# Altium project dashcam_cpu_v2.0.PrjPcb (part 7 of 13)

## Sheet dram_lpddr4.SchDoc
size A2; SheetNumber: 9; SheetTotal: 15
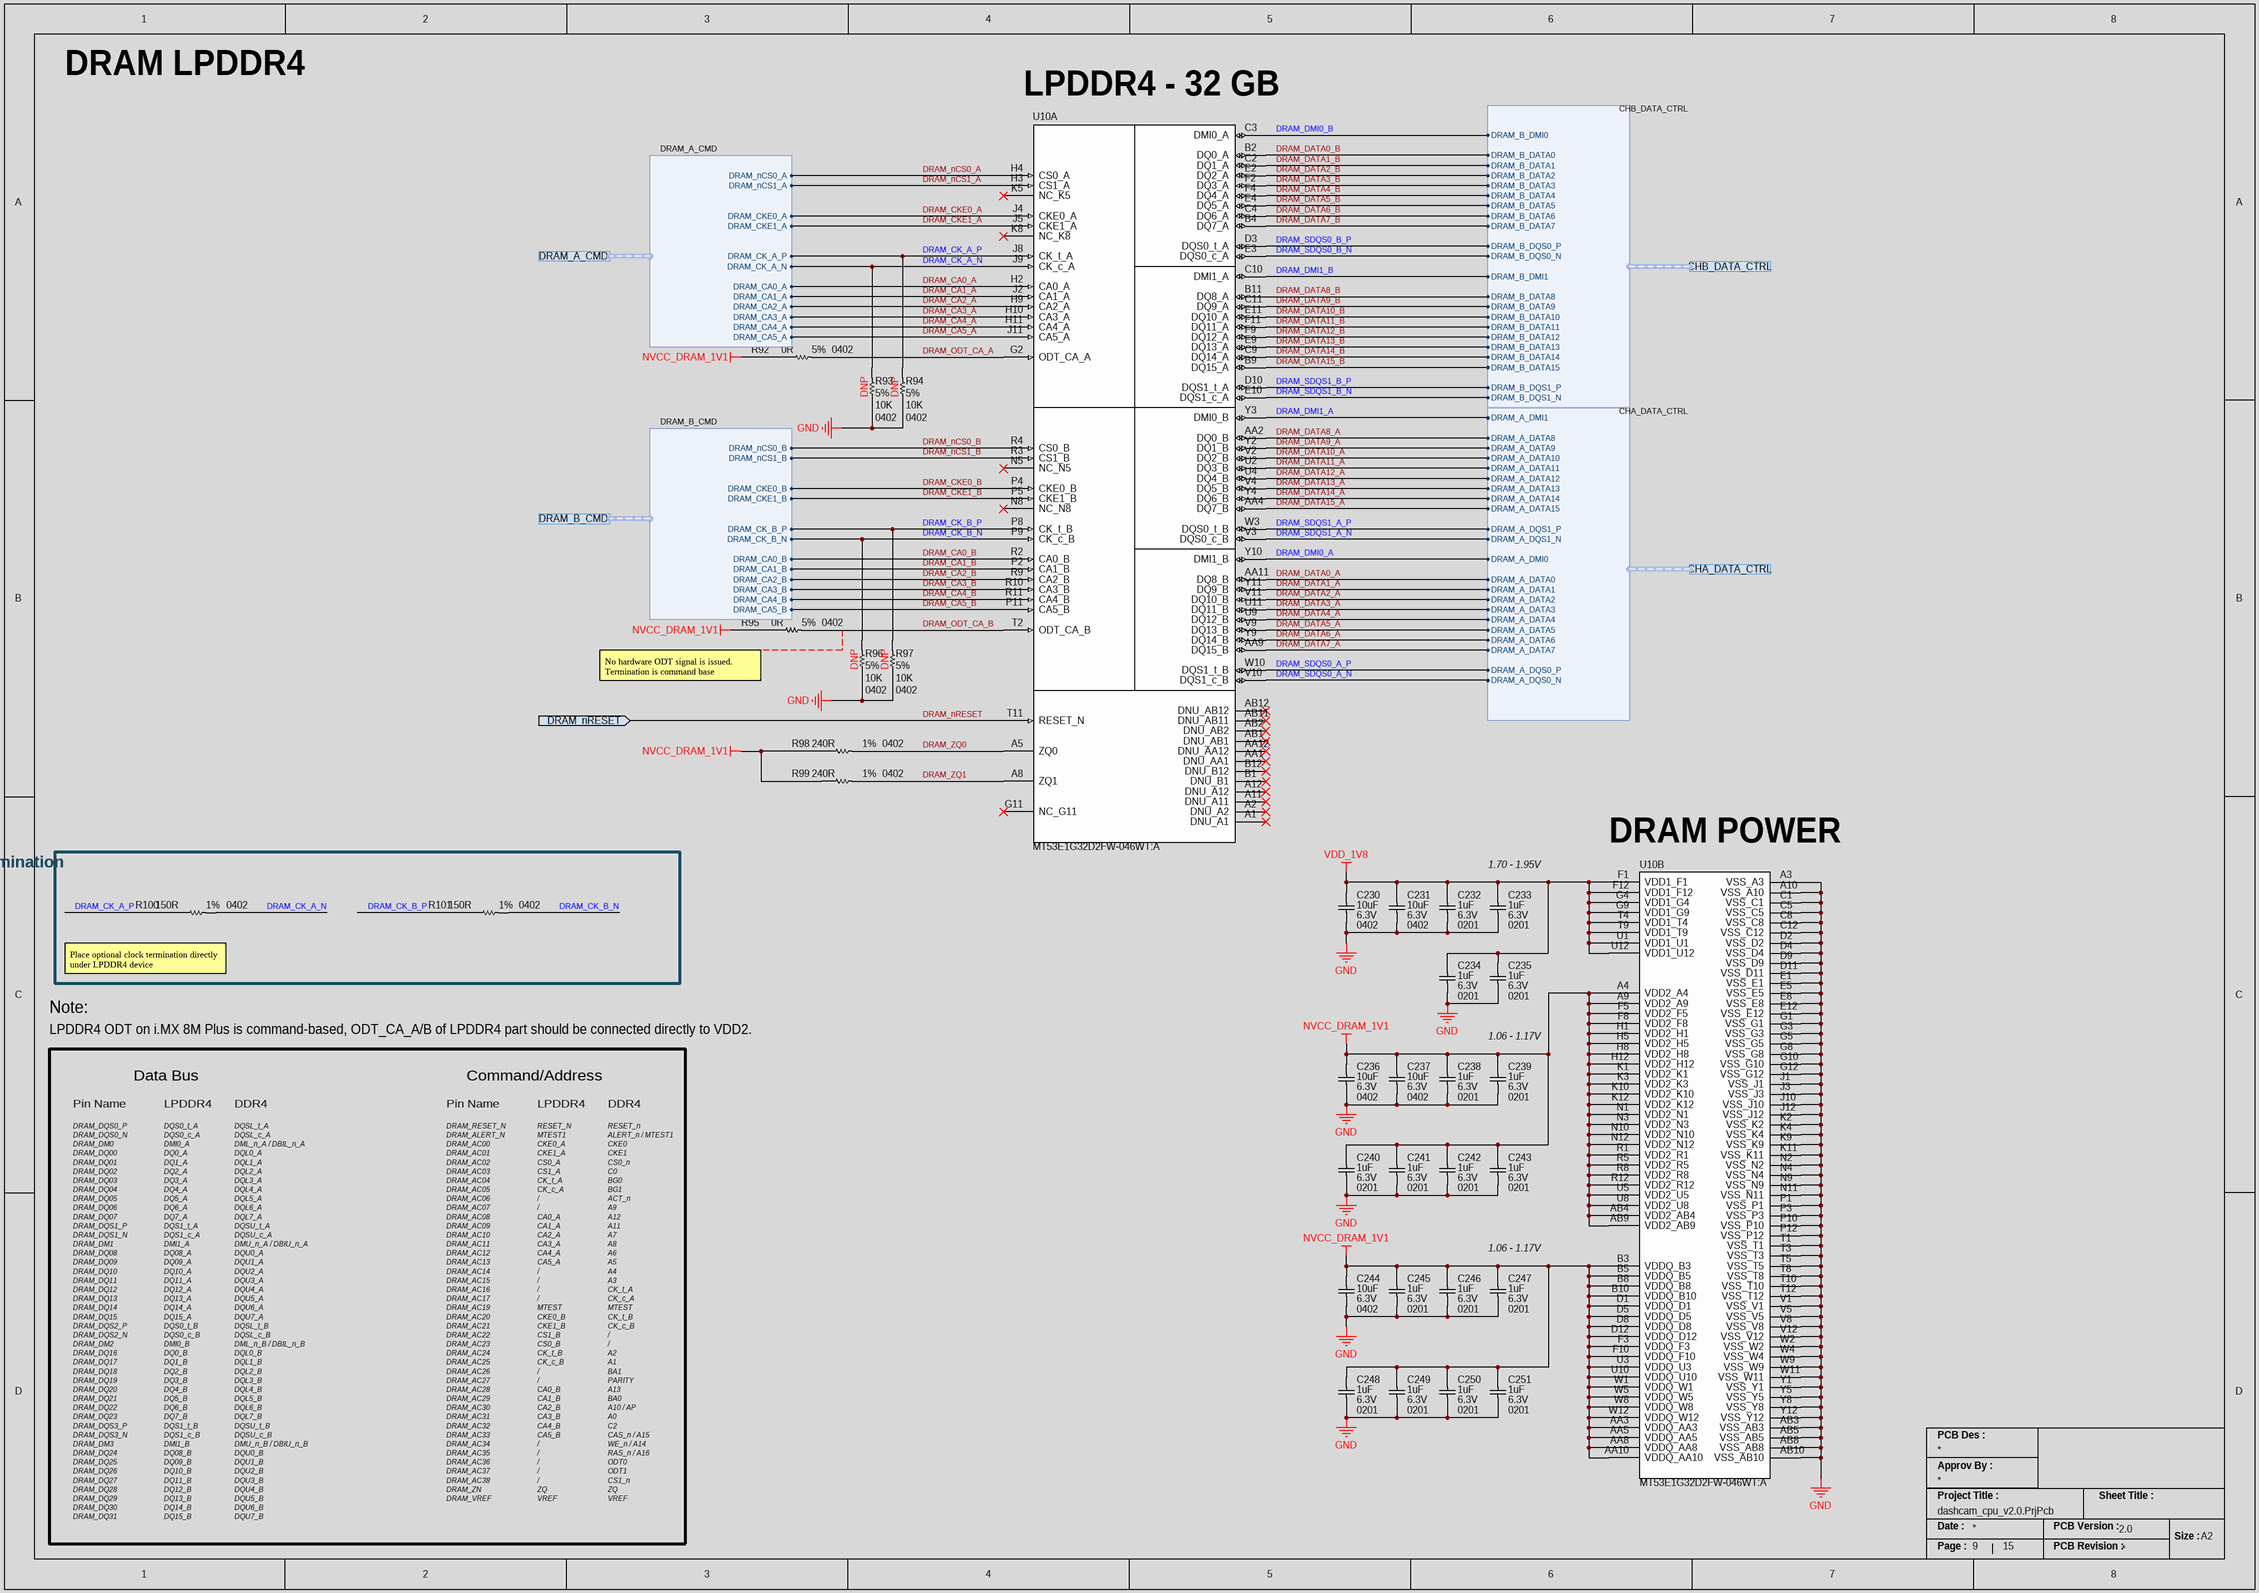
[diagram p9: dram_lpddr4.SchDoc]

### Parts
C230  Case/Package: 0402  Capacitance: 10uF  Voltage Rating: 6.3V  [CAP_0402_CAPC1005X05N]  (hidden comment: CL05A106MQ5NUNC)
C231  Case/Package: 0402  Capacitance: 10uF  Voltage Rating: 6.3V  [CAP_0402_CAPC1005X05N]  (hidden comment: CL05A106MQ5NUNC)
C232  Voltage Rating (DC): 6.3V  Capacitance: 1uF  Case/Package: 0201  [CAP_0201_CAPC0603X03N]  (hidden comment: 02016D105MAT2A)
C233  Voltage Rating (DC): 6.3V  Capacitance: 1uF  Case/Package: 0201  [CAP_0201_CAPC0603X03N]  (hidden comment: 02016D105MAT2A)
C234  Voltage Rating (DC): 6.3V  Capacitance: 1uF  Case/Package: 0201  [CAP_0201_CAPC0603X03N]  (hidden comment: 02016D105MAT2A)
C235  Voltage Rating (DC): 6.3V  Capacitance: 1uF  Case/Package: 0201  [CAP_0201_CAPC0603X03N]  (hidden comment: 02016D105MAT2A)
C236  Case/Package: 0402  Capacitance: 10uF  Voltage Rating: 6.3V  [CAP_0402_CAPC1005X05N]  (hidden comment: CL05A106MQ5NUNC)
C237  Case/Package: 0402  Capacitance: 10uF  Voltage Rating: 6.3V  [CAP_0402_CAPC1005X05N]  (hidden comment: CL05A106MQ5NUNC)
C238  Voltage Rating (DC): 6.3V  Capacitance: 1uF  Case/Package: 0201  [CAP_0201_CAPC0603X03N]  (hidden comment: 02016D105MAT2A)
C239  Voltage Rating (DC): 6.3V  Capacitance: 1uF  Case/Package: 0201  [CAP_0201_CAPC0603X03N]  (hidden comment: 02016D105MAT2A)
C240  Voltage Rating (DC): 6.3V  Capacitance: 1uF  Case/Package: 0201  [CAP_0201_CAPC0603X03N]  (hidden comment: 02016D105MAT2A)
C241  Voltage Rating (DC): 6.3V  Capacitance: 1uF  Case/Package: 0201  [CAP_0201_CAPC0603X03N]  (hidden comment: 02016D105MAT2A)
C242  Voltage Rating (DC): 6.3V  Capacitance: 1uF  Case/Package: 0201  [CAP_0201_CAPC0603X03N]  (hidden comment: 02016D105MAT2A)
C243  Voltage Rating (DC): 6.3V  Capacitance: 1uF  Case/Package: 0201  [CAP_0201_CAPC0603X03N]  (hidden comment: 02016D105MAT2A)
C244  Case/Package: 0402  Capacitance: 10uF  Voltage Rating: 6.3V  [CAP_0402_CAPC1005X05N]  (hidden comment: CL05A106MQ5NUNC)
C245  Voltage Rating (DC): 6.3V  Capacitance: 1uF  Case/Package: 0201  [CAP_0201_CAPC0603X03N]  (hidden comment: 02016D105MAT2A)
C246  Voltage Rating (DC): 6.3V  Capacitance: 1uF  Case/Package: 0201  [CAP_0201_CAPC0603X03N]  (hidden comment: 02016D105MAT2A)
C247  Voltage Rating (DC): 6.3V  Capacitance: 1uF  Case/Package: 0201  [CAP_0201_CAPC0603X03N]  (hidden comment: 02016D105MAT2A)
C248  Voltage Rating (DC): 6.3V  Capacitance: 1uF  Case/Package: 0201  [CAP_0201_CAPC0603X03N]  (hidden comment: 02016D105MAT2A)
C249  Voltage Rating (DC): 6.3V  Capacitance: 1uF  Case/Package: 0201  [CAP_0201_CAPC0603X03N]  (hidden comment: 02016D105MAT2A)
C250  Voltage Rating (DC): 6.3V  Capacitance: 1uF  Case/Package: 0201  [CAP_0201_CAPC0603X03N]  (hidden comment: 02016D105MAT2A)
C251  Voltage Rating (DC): 6.3V  Capacitance: 1uF  Case/Package: 0201  [CAP_0201_CAPC0603X03N]  (hidden comment: 02016D105MAT2A)
R92  Case Code (Imperial): 0402  Tolerance: 5%  Resistance: 0R  [RES_0402_RESC1005X04N]  (hidden comment: ERJ-2GE0R00X)
R93  Tolerance: 5%  Resistance: 10K  Case/Package: 0402  [RES_0402_RESC1005X04N]  (hidden comment: ERJ-2GEJ103X)
R94  Tolerance: 5%  Resistance: 10K  Case/Package: 0402  [RES_0402_RESC1005X04N]  (hidden comment: ERJ-2GEJ103X)
R95  Case Code (Imperial): 0402  Tolerance: 5%  Resistance: 0R  [RES_0402_RESC1005X04N]  (hidden comment: ERJ-2GE0R00X)
R96  Tolerance: 5%  Resistance: 10K  Case/Package: 0402  [RES_0402_RESC1005X04N]  (hidden comment: ERJ-2GEJ103X)
R97  Tolerance: 5%  Resistance: 10K  Case/Package: 0402  [RES_0402_RESC1005X04N]  (hidden comment: ERJ-2GEJ103X)
R98  Tolerance: 1%  Resistance: 240R  Case/Package: 0402  [RES_0402_RESC1005X04N]  (hidden comment: RC0402FR-07240RL)
R99  Tolerance: 1%  Resistance: 240R  Case/Package: 0402  [RES_0402_RESC1005X04N]  (hidden comment: RC0402FR-07240RL)
R100  Tolerance: 1%  Resistance: 150R  Case/Package: 0402  [RES_0402_RESC1005X04N]  (hidden comment: CR0402-FX-1500GLF)
R101  Tolerance: 1%  Resistance: 150R  Case/Package: 0402  [RES_0402_RESC1005X04N]  (hidden comment: CR0402-FX-1500GLF)
U10  MT53E1G32D2FW-046WT:A  [IC_DRAM_BGA200_0P65X0P8_10P1X14P6]  (parts A,B of 2)

### Blocks framed on the sheet
Clock Termination: R100 R101

### Ports
CHA_DATA_CTRL (harness CHA_DATA_CTRL), CHB_DATA_CTRL (harness CHB_DATA_CTRL), DRAM_A_CMD (harness DRAM_A_CMD), DRAM_B_CMD (harness DRAM_B_CMD), DRAM_nRESET (in)

### Harnesses
DRAM_A_CMD: DRAM_CA0_A, DRAM_CA1_A, DRAM_CA2_A, DRAM_CA3_A, DRAM_CA4_A, DRAM_CA5_A, DRAM_nCS0_A, DRAM_nCS1_A, DRAM_CKE0_A, DRAM_CKE1_A, DRAM_CK_A_P, DRAM_CK_A_N
DRAM_B_CMD: DRAM_CA0_B, DRAM_CA1_B, DRAM_CA2_B, DRAM_CA3_B, DRAM_CA4_B, DRAM_CA5_B, DRAM_nCS0_B, DRAM_nCS1_B, DRAM_CKE0_B, DRAM_CKE1_B, DRAM_CK_B_P, DRAM_CK_B_N
CHB_DATA_CTRL: DRAM_B_DATA0, DRAM_B_DATA1, DRAM_B_DATA2, DRAM_B_DATA3, DRAM_B_DATA4, DRAM_B_DATA5, DRAM_B_DATA6, DRAM_B_DATA7, DRAM_B_DATA8, DRAM_B_DATA9, DRAM_B_DATA10, DRAM_B_DATA11, DRAM_B_DATA12, DRAM_B_DATA13, DRAM_B_DATA14, DRAM_B_DATA15, DRAM_B_DMI0, DRAM_B_DMI1, DRAM_B_DQS0_P, DRAM_B_DQS0_N, DRAM_B_DQS1_P, DRAM_B_DQS1_N
CHA_DATA_CTRL: DRAM_A_DATA0, DRAM_A_DATA1, DRAM_A_DATA2, DRAM_A_DATA3, DRAM_A_DATA4, DRAM_A_DATA5, DRAM_A_DATA6, DRAM_A_DATA7, DRAM_A_DATA8, DRAM_A_DATA9, DRAM_A_DATA10, DRAM_A_DATA11, DRAM_A_DATA12, DRAM_A_DATA13, DRAM_A_DATA14, DRAM_A_DATA15, DRAM_A_DMI0, DRAM_A_DMI1, DRAM_A_DQS0_P, DRAM_A_DQS0_N, DRAM_A_DQS1_P, DRAM_A_DQS1_N

### Nets
GND: C230.1 C231.1 C232.1 C233.1 C234.1 C235.1 C236.1 C237.1 C238.1 C239.1 C240.1 C241.1 C242.1 C243.1 C244.1 C245.1 C246.1 C247.1 C248.1 C249.1 C250.1 C251.1 R93.1 R94.1 R96.1 R97.1 U10.A3(VSS_A3) U10.A10(VSS_A10) U10.AB3(VSS_AB3) U10.AB5(VSS_AB5) U10.AB8(VSS_AB8) U10.AB10(VSS_AB10) U10.C1(VSS_C1) U10.C5(VSS_C5) U10.C8(VSS_C8) U10.C12(VSS_C12) U10.D2(VSS_D2) U10.D4(VSS_D4) U10.D9(VSS_D9) U10.D11(VSS_D11) U10.E1(VSS_E1) U10.E5(VSS_E5) U10.E8(VSS_E8) U10.E12(VSS_E12) U10.G1(VSS_G1) U10.G3(VSS_G3) U10.G5(VSS_G5) U10.G8(VSS_G8) U10.G10(VSS_G10) U10.G12(VSS_G12) U10.J1(VSS_J1) U10.J3(VSS_J3) U10.J10(VSS_J10) U10.J12(VSS_J12) U10.K2(VSS_K2) U10.K4(VSS_K4) U10.K9(VSS_K9) U10.K11(VSS_K11) U10.N2(VSS_N2) U10.N4(VSS_N4) U10.N9(VSS_N9) U10.N11(VSS_N11) U10.P1(VSS_P1) U10.P3(VSS_P3) U10.P10(VSS_P10) U10.P12(VSS_P12) U10.T1(VSS_T1) U10.T3(VSS_T3) U10.T5(VSS_T5) U10.T8(VSS_T8) U10.T10(VSS_T10) U10.T12(VSS_T12) U10.V1(VSS_V1) U10.V5(VSS_V5) U10.V8(VSS_V8) U10.V12(VSS_V12) U10.W2(VSS_W2) U10.W4(VSS_W4) U10.W9(VSS_W9) U10.W11(VSS_W11) U10.Y1(VSS_Y1) U10.Y5(VSS_Y5) U10.Y8(VSS_Y8) U10.Y12(VSS_Y12)
NVCC_DRAM_1V1: C236.2 C237.2 C238.2 C239.2 C240.2 C241.2 C242.2 C243.2 C244.2 C245.2 C246.2 C247.2 C248.2 C249.2 C250.2 C251.2 R92.1 R95.1 R98.1 R99.1 U10.A4(VDD2_A4) U10.A9(VDD2_A9) U10.AA3(VDDQ_AA3) U10.AA5(VDDQ_AA5) U10.AA8(VDDQ_AA8) U10.AA10(VDDQ_AA10) U10.AB4(VDD2_AB4) U10.AB9(VDD2_AB9) U10.B3(VDDQ_B3) U10.B5(VDDQ_B5) U10.B8(VDDQ_B8) U10.B10(VDDQ_B10) U10.D1(VDDQ_D1) U10.D5(VDDQ_D5) U10.D8(VDDQ_D8) U10.D12(VDDQ_D12) U10.F3(VDDQ_F3) U10.F5(VDD2_F5) U10.F8(VDD2_F8) U10.F10(VDDQ_F10) U10.H1(VDD2_H1) U10.H5(VDD2_H5) U10.H8(VDD2_H8) U10.H12(VDD2_H12) U10.K1(VDD2_K1) U10.K3(VDD2_K3) U10.K10(VDD2_K10) U10.K12(VDD2_K12) U10.N1(VDD2_N1) U10.N3(VDD2_N3) U10.N10(VDD2_N10) U10.N12(VDD2_N12) U10.R1(VDD2_R1) U10.R5(VDD2_R5) U10.R8(VDD2_R8) U10.R12(VDD2_R12) U10.U3(VDDQ_U3) U10.U5(VDD2_U5) U10.U8(VDD2_U8) U10.U10(VDDQ_U10) U10.W1(VDDQ_W1) U10.W5(VDDQ_W5) U10.W8(VDDQ_W8) U10.W12(VDDQ_W12)
VDD_1V8: C230.2 C231.2 C232.2 C233.2 C234.2 C235.2 U10.F1(VDD1_F1) U10.F12(VDD1_F12) U10.G4(VDD1_G4) U10.G9(VDD1_G9) U10.T4(VDD1_T4) U10.T9(VDD1_T9) U10.U1(VDD1_U1) U10.U12(VDD1_U12)
DRAM_CA0_A: U10.H2(CA0_A) ; port DRAM_A_CMD.DRAM_CA0_A
DRAM_CA0_B: U10.R2(CA0_B) ; port DRAM_B_CMD.DRAM_CA0_B
DRAM_CA1_A: U10.J2(CA1_A) ; port DRAM_A_CMD.DRAM_CA1_A
DRAM_CA1_B: U10.P2(CA1_B) ; port DRAM_B_CMD.DRAM_CA1_B
DRAM_CA2_A: U10.H9(CA2_A) ; port DRAM_A_CMD.DRAM_CA2_A
DRAM_CA2_B: U10.R9(CA2_B) ; port DRAM_B_CMD.DRAM_CA2_B
DRAM_CA3_A: U10.H10(CA3_A) ; port DRAM_A_CMD.DRAM_CA3_A
DRAM_CA3_B: U10.R10(CA3_B) ; port DRAM_B_CMD.DRAM_CA3_B
DRAM_CA4_A: U10.H11(CA4_A) ; port DRAM_A_CMD.DRAM_CA4_A
DRAM_CA4_B: U10.R11(CA4_B) ; port DRAM_B_CMD.DRAM_CA4_B
DRAM_CA5_A: U10.J11(CA5_A) ; port DRAM_A_CMD.DRAM_CA5_A
DRAM_CA5_B: U10.P11(CA5_B) ; port DRAM_B_CMD.DRAM_CA5_B
DRAM_CK_A_N: R93.2 R100.2 U10.J9(CK_c_A) ; port DRAM_A_CMD.DRAM_CK_A_N
DRAM_CK_A_P: R94.2 R100.1 U10.J8(CK_t_A) ; port DRAM_A_CMD.DRAM_CK_A_P
DRAM_CK_B_N: R96.2 R101.2 U10.P9(CK_c_B) ; port DRAM_B_CMD.DRAM_CK_B_N
DRAM_CK_B_P: R97.2 R101.1 U10.P8(CK_t_B) ; port DRAM_B_CMD.DRAM_CK_B_P
DRAM_CKE0_A: U10.J4(CKE0_A) ; port DRAM_A_CMD.DRAM_CKE0_A
DRAM_CKE0_B: U10.P4(CKE0_B) ; port DRAM_B_CMD.DRAM_CKE0_B
DRAM_CKE1_A: U10.J5(CKE1_A) ; port DRAM_A_CMD.DRAM_CKE1_A
DRAM_CKE1_B: U10.P5(CKE1_B) ; port DRAM_B_CMD.DRAM_CKE1_B
DRAM_DATA0_A: U10.AA11(DQ8_B) ; port CHA_DATA_CTRL.DRAM_A_DATA0  [project net DRAM_A_DATA0]
DRAM_DATA0_B: U10.B2(DQ0_A) ; port CHB_DATA_CTRL.DRAM_B_DATA0  [project net DRAM_B_DATA0]
DRAM_DATA1_A: U10.Y11(DQ9_B) ; port CHA_DATA_CTRL.DRAM_A_DATA1  [project net DRAM_A_DATA1]
DRAM_DATA1_B: U10.C2(DQ1_A) ; port CHB_DATA_CTRL.DRAM_B_DATA1  [project net DRAM_B_DATA1]
DRAM_DATA2_A: U10.V11(DQ10_B) ; port CHA_DATA_CTRL.DRAM_A_DATA2  [project net DRAM_A_DATA2]
DRAM_DATA2_B: U10.E2(DQ2_A) ; port CHB_DATA_CTRL.DRAM_B_DATA2  [project net DRAM_B_DATA2]
DRAM_DATA3_A: U10.U11(DQ11_B) ; port CHA_DATA_CTRL.DRAM_A_DATA3  [project net DRAM_A_DATA3]
DRAM_DATA3_B: U10.F2(DQ3_A) ; port CHB_DATA_CTRL.DRAM_B_DATA3  [project net DRAM_B_DATA3]
DRAM_DATA4_A: U10.U9(DQ12_B) ; port CHA_DATA_CTRL.DRAM_A_DATA4  [project net DRAM_A_DATA4]
DRAM_DATA4_B: U10.F4(DQ4_A) ; port CHB_DATA_CTRL.DRAM_B_DATA4  [project net DRAM_B_DATA4]
DRAM_DATA5_A: U10.V9(DQ13_B) ; port CHA_DATA_CTRL.DRAM_A_DATA5  [project net DRAM_A_DATA5]
DRAM_DATA5_B: U10.E4(DQ5_A) ; port CHB_DATA_CTRL.DRAM_B_DATA5  [project net DRAM_B_DATA5]
DRAM_DATA6_A: U10.Y9(DQ14_B) ; port CHA_DATA_CTRL.DRAM_A_DATA6  [project net DRAM_A_DATA6]
DRAM_DATA6_B: U10.C4(DQ6_A) ; port CHB_DATA_CTRL.DRAM_B_DATA6  [project net DRAM_B_DATA6]
DRAM_DATA7_A: U10.AA9(DQ15_B) ; port CHA_DATA_CTRL.DRAM_A_DATA7  [project net DRAM_A_DATA7]
DRAM_DATA7_B: U10.B4(DQ7_A) ; port CHB_DATA_CTRL.DRAM_B_DATA7  [project net DRAM_B_DATA7]
DRAM_DATA8_A: U10.AA2(DQ0_B) ; port CHA_DATA_CTRL.DRAM_A_DATA8  [project net DRAM_A_DATA8]
DRAM_DATA8_B: U10.B11(DQ8_A) ; port CHB_DATA_CTRL.DRAM_B_DATA8  [project net DRAM_B_DATA8]
DRAM_DATA9_A: U10.Y2(DQ1_B) ; port CHA_DATA_CTRL.DRAM_A_DATA9  [project net DRAM_A_DATA9]
DRAM_DATA9_B: U10.C11(DQ9_A) ; port CHB_DATA_CTRL.DRAM_B_DATA9  [project net DRAM_B_DATA9]
DRAM_DATA10_A: U10.V2(DQ2_B) ; port CHA_DATA_CTRL.DRAM_A_DATA10  [project net DRAM_A_DATA10]
DRAM_DATA10_B: U10.E11(DQ10_A) ; port CHB_DATA_CTRL.DRAM_B_DATA10  [project net DRAM_B_DATA10]
DRAM_DATA11_A: U10.U2(DQ3_B) ; port CHA_DATA_CTRL.DRAM_A_DATA11  [project net DRAM_A_DATA11]
DRAM_DATA11_B: U10.F11(DQ11_A) ; port CHB_DATA_CTRL.DRAM_B_DATA11  [project net DRAM_B_DATA11]
DRAM_DATA12_A: U10.U4(DQ4_B) ; port CHA_DATA_CTRL.DRAM_A_DATA12  [project net DRAM_A_DATA12]
DRAM_DATA12_B: U10.F9(DQ12_A) ; port CHB_DATA_CTRL.DRAM_B_DATA12  [project net DRAM_B_DATA12]
DRAM_DATA13_A: U10.V4(DQ5_B) ; port CHA_DATA_CTRL.DRAM_A_DATA13  [project net DRAM_A_DATA13]
DRAM_DATA13_B: U10.E9(DQ13_A) ; port CHB_DATA_CTRL.DRAM_B_DATA13  [project net DRAM_B_DATA13]
DRAM_DATA14_A: U10.Y4(DQ6_B) ; port CHA_DATA_CTRL.DRAM_A_DATA14  [project net DRAM_A_DATA14]
DRAM_DATA14_B: U10.C9(DQ14_A) ; port CHB_DATA_CTRL.DRAM_B_DATA14  [project net DRAM_B_DATA14]
DRAM_DATA15_A: U10.AA4(DQ7_B) ; port CHA_DATA_CTRL.DRAM_A_DATA15  [project net DRAM_A_DATA15]
DRAM_DATA15_B: U10.B9(DQ15_A) ; port CHB_DATA_CTRL.DRAM_B_DATA15  [project net DRAM_B_DATA15]
DRAM_DMI0_A: U10.Y10(DMI1_B) ; port CHA_DATA_CTRL.DRAM_A_DMI0  [project net DRAM_A_DMI0]
DRAM_DMI0_B: U10.C3(DMI0_A) ; port CHB_DATA_CTRL.DRAM_B_DMI0  [project net DRAM_B_DMI0]
DRAM_DMI1_A: U10.Y3(DMI0_B) ; port CHA_DATA_CTRL.DRAM_A_DMI1  [project net DRAM_A_DMI1]
DRAM_DMI1_B: U10.C10(DMI1_A) ; port CHB_DATA_CTRL.DRAM_B_DMI1  [project net DRAM_B_DMI1]
DRAM_nCS0_A: U10.H4(CS0_A) ; port DRAM_A_CMD.DRAM_nCS0_A
DRAM_nCS0_B: U10.R4(CS0_B) ; port DRAM_B_CMD.DRAM_nCS0_B
DRAM_nCS1_A: U10.H3(CS1_A) ; port DRAM_A_CMD.DRAM_nCS1_A
DRAM_nCS1_B: U10.R3(CS1_B) ; port DRAM_B_CMD.DRAM_nCS1_B
DRAM_nRESET: U10.T11(RESET_N) ; port DRAM_nRESET
DRAM_ODT_CA_A: R92.2 U10.G2(ODT_CA_A)
DRAM_ODT_CA_B: R95.2 U10.T2(ODT_CA_B)
DRAM_SDQS0_A_N: U10.V10(DQS1_c_B) ; port CHA_DATA_CTRL.DRAM_A_DQS0_N  [project net DRAM_A_DQS0_N]
DRAM_SDQS0_A_P: U10.W10(DQS1_t_B) ; port CHA_DATA_CTRL.DRAM_A_DQS0_P  [project net DRAM_A_DQS0_P]
DRAM_SDQS0_B_N: U10.E3(DQS0_c_A) ; port CHB_DATA_CTRL.DRAM_B_DQS0_N  [project net DRAM_B_DQS0_N]
DRAM_SDQS0_B_P: U10.D3(DQS0_t_A) ; port CHB_DATA_CTRL.DRAM_B_DQS0_P  [project net DRAM_B_DQS0_P]
DRAM_SDQS1_A_N: U10.V3(DQS0_c_B) ; port CHA_DATA_CTRL.DRAM_A_DQS1_N  [project net DRAM_A_DQS1_N]
DRAM_SDQS1_A_P: U10.W3(DQS0_t_B) ; port CHA_DATA_CTRL.DRAM_A_DQS1_P  [project net DRAM_A_DQS1_P]
DRAM_SDQS1_B_N: U10.E10(DQS1_c_A) ; port CHB_DATA_CTRL.DRAM_B_DQS1_N  [project net DRAM_B_DQS1_N]
DRAM_SDQS1_B_P: U10.D10(DQS1_t_A) ; port CHB_DATA_CTRL.DRAM_B_DQS1_P  [project net DRAM_B_DQS1_P]
DRAM_ZQ0: R98.2 U10.A5(ZQ0)
DRAM_ZQ1: R99.2 U10.A8(ZQ1)

Not connected (* = marked no-connect by the designer): U10 A1(DNU_A1)* A2(DNU_A2)* A11(DNU_A11)* A12(DNU_A12)* AA1(DNU_AA1)* AA12(DNU_AA12)* AB1(DNU_AB1)* AB2(DNU_AB2)* AB11(DNU_AB11)* AB12(DNU_AB12)* B1(DNU_B1)* B12(DNU_B12)* G11(NC_G11)* K5(NC_K5)* K8(NC_K8)* N5(NC_N5)* N8(NC_N8)*

### Notes on the sheet
- DRAM LPDDR4
- (near U10) LPDDR4 - 32 GB
- (near R93) DNP
- (near R94) DNP
- (near R95) No hardware ODT signal is issued. Termination is command base
- (near R96) DNP
- (near R97) DNP
- (near U10) DRAM POWER
- (near C233) 1.70 - 1.95V
- (near R100) Place optional clock termination directly under LPDDR4 device
- Note:
- LPDDR4 ODT on i.MX 8M Plus is command-based, ODT_CA_A/B of LPDDR4 part should be connected directly to VDD2.
- 1.06 - 1.17V
- Data Bus
- Command/Address
- Pin Name
- LPDDR4
- DDR4
- (near C247) 1.06 - 1.17V
- DRAM_RESET_N
  DRAM_ALERT_N
  DRAM_AC00
  DRAM_AC01
  DRAM_AC02
  DRAM_AC03
  DRAM_AC04
  DRAM_AC05
  DRAM_AC06
  DRAM_AC07
  DRAM_AC08
  DRAM_AC09
  DRAM_AC10
  DRAM_AC11
  DRAM_AC12
  DRAM_AC13
  DRAM_AC14
  DRAM_AC15
  DRAM_AC16
  DRAM_AC17
  DRAM_AC19
  DRAM_AC20
  DRAM_AC21
  DRAM_AC22
  DRAM_AC23
  DRAM_AC24
  DRAM_AC25
  DRAM_AC26
  DRAM_AC27
  DRAM_AC28
  DRAM_AC29
  DRAM_AC30
  DRAM_AC31
  DRAM_AC32
  DRAM_AC33
  DRAM_AC34
  DRAM_AC35
  DRAM_AC36
  DRAM_AC37
  DRAM_AC38
  DRAM_ZN
  DRAM_VREF
- RESET_N
  MTEST1
  CKE0_A
  CKE1_A
  CS0_A
  CS1_A
  CK_t_A
  CK_c_A
  /
  /
  CA0_A
  CA1_A
  CA2_A
  CA3_A
  CA4_A
  CA5_A
  /
  /
  /
  /
  MTEST
  CKE0_B
  CKE1_B
  CS1_B
  CS0_B
  CK_t_B
  CK_c_B
  /
  /
  CA0_B
  CA1_B
  CA2_B
  CA3_B
  CA4_B
  CA5_B
  /
  /
  /
  /
  /
  ZQ
  VREF
- RESET_n
  ALERT_n / MTEST1
  CKE0
  CKE1
  CS0_n
  C0
  BG0
  BG1
  ACT_n
  A9
  A12
  A11
  A7
  A8
  A6
  A5
  A4
  A3
  CK_t_A
  CK_c_A
  MTEST
  CK_t_B
  CK_c_B
  /
  /
  A2
  A1
  BA1
  PARITY
  A13
  BA0
  A10 / AP
  A0
  C2
  CAS_n / A15
  WE_n / A14
  RAS_n / A16
  ODT0
  ODT1
  CS1_n
  ZQ
  VREF
- DRAM_DQS0_P
  DRAM_DQS0_N
  DRAM_DM0
  DRAM_DQ00
  DRAM_DQ01
  DRAM_DQ02
  DRAM_DQ03
  DRAM_DQ04
  DRAM_DQ05
  DRAM_DQ06
  DRAM_DQ07
  DRAM_DQS1_P
  DRAM_DQS1_N
  DRAM_DM1
  DRAM_DQ08
  DRAM_DQ09
  DRAM_DQ10
  DRAM_DQ11
  DRAM_DQ12
  DRAM_DQ13
  DRAM_DQ14
  DRAM_DQ15
  DRAM_DQS2_P
  DRAM_DQS2_N
  DRAM_DM2
  DRAM_DQ16
  DRAM_DQ17
  DRAM_DQ18
  DRAM_DQ19
  DRAM_DQ20
  DRAM_DQ21
  DRAM_DQ22
  DRAM_DQ23
  DRAM_DQS3_P
  DRAM_DQS3_N
  DRAM_DM3
  DRAM_DQ24
  DRAM_DQ25
  DRAM_DQ26
  DRAM_DQ27
  DRAM_DQ28
  DRAM_DQ29
  DRAM_DQ30
  DRAM_DQ31
- DQS0_t_A
  DQS0_c_A
  DMI0_A
  DQ0_A
  DQ1_A
  DQ2_A
  DQ3_A
  DQ4_A
  DQ5_A
  DQ6_A
  DQ7_A
  DQS1_t_A
  DQS1_c_A
  DMI1_A
  DQ08_A
  DQ09_A
  DQ10_A
  DQ11_A
  DQ12_A
  DQ13_A
  DQ14_A
  DQ15_A
  DQS0_t_B
  DQS0_c_B
  DMI0_B
  DQ0_B
  DQ1_B
  DQ2_B
  DQ3_B
  DQ4_B
  DQ5_B
  DQ6_B
  DQ7_B
  DQS1_t_B
  DQS1_c_B
  DMI1_B
  DQ08_B
  DQ09_B
  DQ10_B
  DQ11_B
  DQ12_B
  DQ13_B
  DQ14_B
  DQ15_B
- DQSL_t_A
  DQSL_c_A
  DML_n_A / DBIL_n_A
  DQL0_A
  DQL1_A
  DQL2_A
  DQL3_A
  DQL4_A
  DQL5_A
  DQL6_A
  DQL7_A
  DQSU_t_A
  DQSU_c_A
  DMU_n_A / DBIU_n_A
  DQU0_A
  DQU1_A
  DQU2_A
  DQU3_A
  DQU4_A
  DQU5_A
  DQU6_A
  DQU7_A
  DQSL_t_B
  DQSL_c_B
  DML_n_B / DBIL_n_B
  DQL0_B
  DQL1_B
  DQL2_B
  DQL3_B
  DQL4_B
  DQL5_B
  DQL6_B
  DQL7_B
  DQSU_t_B
  DQSU_c_B
  DMU_n_B / DBIU_n_B
  DQU0_B
  DQU1_B
  DQU2_B
  DQU3_B
  DQU4_B
  DQU5_B
  DQU6_B
  DQU7_B
- PCB Des :
- Approv By :
- Project Title :
- Sheet Title :
- Date :
- Page :
- PCB Version :
- PCB Revision :
- Size :
- A2

### Library data of the parts
C230 C231 C236 C237 C244 = CAP_10UF_6.3V_X5R_0402: Cap Ceramic 10uF 6.3V X5R 20% SMD 0402 85C T/R; Manufacturer: Samsung; Supplier 1: Digikey; Manufacturer Part Number: CL05A106MQ5NUNC; RoHS: Yes; Category: Ceramic Capacitors; Stock 1: 6097180; Pricing 1: 1=0.24, 10=0.153, 50=0.0968, 100=0.0774, 500=0.05588, 1000=0.04943, 2500=0.04728, 5000=0.04299 (USD); Mount: Surface Mount; Case Code (Metric): 1005; Case Code (Imperial): 0402; Min Operating Temperature: -55°C; Max Operating Temperature: 85°C; Packaging: Tape and Reel; Tolerance: 20%; Dielectric: X5R; Series: CL; Package Quantity: 1; Construction: Flat; Length: 1mm; Width: 0.02inch; Height: 0.5mm; Depth: 0.5mm; Thickness: 0.028inch; Radiation Hardening: No; RoHS Compliant: Yes; ComponentLink1URL: https://datasheet.ciiva.com/16437/cl05a106mq5nunc-16437356.pdf?src-supplier=Future+Electronics; ComponentLink1Description: https://datasheet.ciiva.com/16437/cl05a106mq5nunc-16437356.pdf?src-supplier=Future+Electronics; ComponentLink2URL: https://datasheet.ciiva.com/26877/getdatasheetpartid-355289-26877841.pdf?src-supplier=Verical; ComponentLink2Description: https://datasheet.ciiva.com/26877/getdatasheetpartid-355289-26877841.pdf?src-supplier=Verical; Supplier Part Number 1: 1276-1451-1-ND
C232-C235 C238-C243 C245-C251 = CAP_1UF_6.3V_X5R_0201: 0201 1 uF 6.3 V ±20 % Tolerance X5R Surface Mount Multilayer Ceramic Capacitor; Manufacturer: Kyocera AVX; Tolerance: 20%; Supplier 1: Mouser; Manufacturer Part Number: 02016D105MAT2A; RoHS: Yes; Category: Ceramic Capacitors; Stock 1: 1026413; Pricing 1: 1=0.1, 10=0.028, 50=0.028, 100=0.014, 1000=0.008, 10000=0.006 (USD); Mount: Surface Mount; Number of Pins: 2; Case Code (Metric): 0603; Case Code (Imperial): 0201; Min Operating Temperature: -55°C; Max Operating Temperature: 85°C; Packaging: Cut Tape; Series: -; Voltage Rating: 6.3V; Package Quantity: 1; Length: 0.024inch; Width: 0.012inch; Thickness: 0.013inch; Depth: 0.3mm; Lead Free: Lead Free; RoHS Compliant: Yes; Reach SVHC Compliant: No; ComponentLink1URL: https://datasheet.ciiva.com/6265/cx5r-6265595.pdf?src-supplier=Digi-Key; ComponentLink1Description: https://datasheet.ciiva.com/6265/cx5r-6265595.pdf?src-supplier=Digi-Key; ComponentLink2URL: https://datasheet.ciiva.com/1123/1666675-1123122.pdf?src-supplier=Element14; ComponentLink2Description: https://datasheet.ciiva.com/1123/1666675-1123122.pdf?src-supplier=Element14; ComponentLink3URL: https://datasheet.ciiva.com/14891/cx5r-14891029.pdf?src-supplier=Digi-Key; ComponentLink3Description: https://datasheet.ciiva.com/14891/cx5r-14891029.pdf?src-supplier=Digi-Key; ComponentLink4URL: https://datasheet.ciiva.com/7614/cx5r-7614682.pdf?src-supplier=Digi-Key; ComponentLink4Description: https://datasheet.ciiva.com/7614/cx5r-7614682.pdf?src-supplier=Digi-Key; ComponentLink5URL: https://datasheet.ciiva.com/14891/cx5r-14891030.pdf?src-supplier=Digi-Key; ComponentLink5Description: https://datasheet.ciiva.com/14891/cx5r-14891030.pdf?src-supplier=Digi-Key; Supplier Part Number 1: 581-02016D105MAT2A; Dielectric: X5R
R92 R95 = RES_0R_5%_100mW_0402: as R2 on sheet mx8m_pmic; Supplier 1: Mouser; Manufacturer Part Number: ERJ-2GE0R00X; RoHS: Yes; Category: Chip SMD Resistors; Stock 1: 10989354; Pricing 1: 1=0.1, 10=0.013, 50=0.013, 100=0.006, 1000=0.004, 2500=0.003, 10000=0.003 (USD); Mount: Surface Mount; Case/Package: 0402; Contact Plating: Tin; Case Code (Metric): 1005; Size Code: 0402; Min Operating Temperature: -55°C; Max Operating Temperature: 155°C; Resistor Type: Thick Film; Packaging: Cut Tape; Package Quantity: 10000; Number of Terminations: 2; Termination: SMD/SMT; Max Power Dissipation: 100mW; Voltage Rating (DC): 50V; Features: Automotive AEC-Q200; Series: ERJ; Construction: Rectangular; Technology: THICK FILM; Length: 1mm; Width: 0.5mm; Height: 0.35mm; Depth: 0.5mm; Ratings: AEC-Q200; Radiation Hardening: No; Reach SVHC Compliant: No; Military Standard: Not; Lead Free: Lead Free; RoHS Compliant: Yes; ComponentLink1URL: https://datasheet.ciiva.com/11821/0900766b80f806dd-11821176.pdf?src-supplier=Rs; ComponentLink1Description: https://datasheet.ciiva.com/11821/0900766b80f806dd-11821176.pdf?src-supplier=Rs; ComponentLink2URL: https://datasheet.ciiva.com/43460/1678796-43460347.pdf?src-supplier=Farnell; ComponentLink2Description: https://datasheet.ciiva.com/43460/1678796-43460347.pdf?src-supplier=Farnell; ComponentLink3URL: https://datasheet.ciiva.com/46389/1678796-46389518.pdf?src-supplier=Element14; ComponentLink3Description: https://datasheet.ciiva.com/46389/1678796-46389518.pdf?src-supplier=Element14; ComponentLink4URL: https://datasheet.ciiva.com/5959/1678796-5959692.pdf?src-supplier=Farnell; ComponentLink4Description: https://datasheet.ciiva.com/5959/1678796-5959692.pdf?src-supplier=Farnell; ComponentLink5URL: https://datasheet.ciiva.com/28695/1678796-28695758.pdf?src-supplier=Element14; ComponentLink5Description: https://datasheet.ciiva.com/28695/1678796-28695758.pdf?src-supplier=Element14; ComponentLink6URL: https://datasheet.ciiva.com/16783/70260739-16783734.pdf?src-supplier=Allied+Electronics; ComponentLink6Description: https://datasheet.ciiva.com/16783/70260739-16783734.pdf?src-supplier=Allied+Electronics; ComponentLink7URL: https://datasheet.ciiva.com/16778/70260739-16778335.pdf?src-supplier=Allied+Electronics; ComponentLink7Description: https://datasheet.ciiva.com/16778/70260739-16778335.pdf?src-supplier=Allied+Electronics; ComponentLink8URL: https://datasheet.ciiva.com/48531/aoa0000ce1-48531077.pdf?src-supplier=Avnet; ComponentLink8Description: https://datasheet.ciiva.com/48531/aoa0000ce1-48531077.pdf?src-supplier=Avnet; ComponentLink9URL: https://datasheet.ciiva.com/30097/4aoa0000ce1-30097116.pdf?src-supplier=Onlinecomponents.com; ComponentLink9Description: https://datasheet.ciiva.com/30097/4aoa0000ce1-30097116.pdf?src-supplier=Onlinecomponents.com; Supplier Part Number 1: 667-ERJ-2GE0R00X
R93 R94 R96 R97 = RES_10K_5%_100mW_0402: as R8 on sheet mx8m_pmic; Supplier 1: Digi-Key; Manufacturer Part Number: ERJ-2GEJ103X; RoHS: Yes; Category: Chip SMD Resistors; Stock 1: 4696986; Pricing 1: 1=0.1, 10=0.021, 50=0.0132, 100=0.011, 500=0.00744, 1000=0.00639, 5000=0.00464 (USD); Mount: Surface Mount; Contact Plating: Tin; Case Code (Metric): 1005; Case Code (Imperial): 0402; Size Code: 0402; Min Operating Temperature: -55°C; Max Operating Temperature: 155°C; Temperature Coefficient: 200ppm/°C; Packaging: Cut Tape; Resistor Type: Thick Film; Package Quantity: 10000; Number of Terminations: 2; Termination: SMD/SMT; Max Power Dissipation: 100mW; Features: Automotive AEC-Q200; Series: ERJ; Resistance Tolerance: 5%; Technology: THICK FILM; Voltage Rating (DC): 50V; Length: 1mm; Width: 0.5mm; Height: 0.35mm; Depth: 0.5mm; Ratings: AEC-Q200; Radiation Hardening: No; Reach SVHC Compliant: No; RoHS Compliant: Yes; Lead Free: 5697LeadFree; ComponentLink1URL: https://datasheet.ciiva.com/27055/1935721-27055112.pdf?src-supplier=Jameco; ComponentLink1Description: https://datasheet.ciiva.com/27055/1935721-27055112.pdf?src-supplier=Jameco; ComponentLink2URL: https://datasheet.ciiva.com/11821/0900766b80f806dd-11821170.pdf?src-supplier=Rs; ComponentLink2Description: https://datasheet.ciiva.com/11821/0900766b80f806dd-11821170.pdf?src-supplier=Rs; ComponentLink3URL: https://datasheet.ciiva.com/43460/1678796-43460391.pdf?src-supplier=Farnell; ComponentLink3Description: https://datasheet.ciiva.com/43460/1678796-43460391.pdf?src-supplier=Farnell; ComponentLink4URL: https://datasheet.ciiva.com/22785/1678796-22785949.pdf?src-supplier=Farnell; ComponentLink4Description: https://datasheet.ciiva.com/22785/1678796-22785949.pdf?src-supplier=Farnell; ComponentLink5URL: https://datasheet.ciiva.com/46371/1678796-46371910.pdf?src-supplier=Element14; ComponentLink5Description: https://datasheet.ciiva.com/46371/1678796-46371910.pdf?src-supplier=Element14; ComponentLink6URL: https://datasheet.ciiva.com/28514/1678796-28514154.pdf?src-supplier=Element14; ComponentLink6Description: https://datasheet.ciiva.com/28514/1678796-28514154.pdf?src-supplier=Element14; ComponentLink7URL: https://datasheet.ciiva.com/24070/aoa0000ce1-37422-24070679.pdf?src-supplier=Mouser; ComponentLink7Description: https://datasheet.ciiva.com/24070/aoa0000ce1-37422-24070679.pdf?src-supplier=Mouser; ComponentLink8URL: https://datasheet.ciiva.com/16767/70260739-16767130.pdf?src-supplier=Allied+Electronics; ComponentLink8Description: https://datasheet.ciiva.com/16767/70260739-16767130.pdf?src-supplier=Allied+Electronics; ComponentLink9URL: https://datasheet.ciiva.com/16774/70260739-16774504.pdf?src-supplier=Allied+Electronics; ComponentLink9Description: https://datasheet.ciiva.com/16774/70260739-16774504.pdf?src-supplier=Allied+Electronics; ComponentLink10URL: https://datasheet.ciiva.com/9194/aoa0000ce1-9194140.pdf?src-supplier=Avnet; ComponentLink10Description: https://datasheet.ciiva.com/9194/aoa0000ce1-9194140.pdf?src-supplier=Avnet; Supplier Part Number 1: P10KJCT-ND
R98 R99 = RES_240R_1%_63mW_0402: SMD Chip Resistor, 240 Ohm, ± 1%, 63 mW, 0402 [1005 Metric], Thick Film, General Purpose; Manufacturer: Yageo; Power Rating: 63mW; Voltage Rating: 50V; Temperature Coefficient: 100ppm/°C; Supplier 1: Digi-Key; Manufacturer Part Number: RC0402FR-07240RL; RoHS: Yes; Category: Chip SMD Resistors; Stock 1: 1880273; Pricing 1: 1=0.1, 10=0.014, 50=0.0084, 100=0.007, 500=0.00464, 1000=0.00396, 5000=0.00282 (USD); Case Code (Metric): 1005; Case Code (Imperial): 0402; Size Code: 0402; Min Operating Temperature: -55°C; Max Operating Temperature: 155°C; Resistor Type: Thick Film; Packaging: Tape and Reel; Number of Terminations: 2; Termination: SMD/SMT; Max Power Dissipation: 63mW; Voltage Rating (DC): 50V; Features: Moisture Resistant; Series: RC; Construction: Rectangular; Resistance Tolerance: 1%; Length: 1mm; Depth: 0.5mm; RoHS Compliant: Yes; Military Standard: Not; Lead Free: Lead Free; Reach SVHC Compliant: Unknown; ComponentLink1URL: https://datasheet.ciiva.com/7849/1018594-7849915.pdf?src-supplier=Element14; ComponentLink1Description: https://datasheet.ciiva.com/7849/1018594-7849915.pdf?src-supplier=Element14; ComponentLink2URL: https://datasheet.ciiva.com/7849/1018594-7849916.pdf?src-supplier=Element14; ComponentLink2Description: https://datasheet.ciiva.com/7849/1018594-7849916.pdf?src-supplier=Element14; ComponentLink3URL: https://datasheet.ciiva.com/2519/pyu-r-int-thick-7-2519158.pdf?src-supplier=Digi-Key; ComponentLink3Description: https://datasheet.ciiva.com/2519/pyu-r-int-thick-7-2519158.pdf?src-supplier=Digi-Key; ComponentLink4URL: https://datasheet.ciiva.com/2519/pyu-r-int-thick-7-2519157.pdf?src-supplier=Digi-Key; ComponentLink4Description: https://datasheet.ciiva.com/2519/pyu-r-int-thick-7-2519157.pdf?src-supplier=Digi-Key; ComponentLink5URL: https://datasheet.ciiva.com/2519/pyu-r-int-thick-7-2519156.pdf?src-supplier=Digi-Key; ComponentLink5Description: https://datasheet.ciiva.com/2519/pyu-r-int-thick-7-2519156.pdf?src-supplier=Digi-Key; ComponentLink6URL: https://datasheet.ciiva.com/12669/pyu-rc0402-51-rohs-l-6-r-12669689.pdf?src-supplier=Mouser; ComponentLink6Description: https://datasheet.ciiva.com/12669/pyu-rc0402-51-rohs-l-6-r-12669689.pdf?src-supplier=Mouser; ComponentLink7URL: https://datasheet.ciiva.com/17419/pyu-rc0402-51-rohs-l-6-r-17419482.pdf?src-supplier=Future+Electronics; ComponentLink7Description: https://datasheet.ciiva.com/17419/pyu-rc0402-51-rohs-l-6-r-17419482.pdf?src-supplier=Future+Electronics; Supplier Part Number 1: 311-240LRCT-ND
R100 R101 = RES_150R_1%_63mW_0402: SMD Chip Resistor, 150 Ohm, ± 1%, 63 mW, 0402 [1005 Metric], Thick Film, General Purpose; Manufacturer: Bourns; Voltage Rating: 50V; Power Rating: 62.5mW; Temperature Coefficient: 100ppm/°C; Max Power Dissipation: 63mW; Supplier 1: Digi-Key; Manufacturer Part Number: CR0402-FX-1500GLF; RoHS: Yes; Category: Chip SMD Resistors; Stock 1: 501068; Pricing 1: 1=0.1, 10=0.011, 50=0.0064, 100=0.0051, 500=0.00326, 1000=0.00275, 5000=0.0019 (USD); Mount: Surface Mount; Case Code (Imperial): 0402; Case Code (Metric): 1005; Contact Plating: Tin; Min Operating Temperature: -55°C; Max Operating Temperature: 125°C; Packaging: Tape and Reel; Package Quantity: 1; Termination: SMD/SMT; Number of Terminations: 2; Series: CR0402; Length: 1mm; Width: 0.5mm; Height: 0.016inch; Thickness: 356um; RoHS Compliant: Yes; ComponentLink1URL: https://datasheet.ciiva.com/6549/cr0402-6549772.pdf?src-supplier=Digi-Key; ComponentLink1Description: https://datasheet.ciiva.com/6549/cr0402-6549772.pdf?src-supplier=Digi-Key; ComponentLink2URL: https://datasheet.ciiva.com/6549/cr0402-6549773.pdf?src-supplier=Digi-Key; ComponentLink2Description: https://datasheet.ciiva.com/6549/cr0402-6549773.pdf?src-supplier=Digi-Key; ComponentLink3URL: https://datasheet.ciiva.com/6549/cr0402-6549774.pdf?src-supplier=Digi-Key; ComponentLink3Description: https://datasheet.ciiva.com/6549/cr0402-6549774.pdf?src-supplier=Digi-Key; ComponentLink4URL: https://datasheet.ciiva.com/9120/cr0402-9120460.pdf?src-supplier=Avnet; ComponentLink4Description: https://datasheet.ciiva.com/9120/cr0402-9120460.pdf?src-supplier=Avnet; Supplier Part Number 1: CR0402-FX-1500GLFCT-ND
U10 = IC_DRAM_32G_MT53E1G32D2FW-046WT:A: LPDDR4 32G 1GX32 FBGA DDP; Manufacturer: Micron Technology; Supplier 1: Digikey; Manufacturer Part Number: MT53E1G32D2FW-046WT:A; RoHS: No; Stock 1: 1349; Pricing 1: 1=26.73, 10=24.892, 25=24.6252, 50=24.0178, 100=21.0842, 250=20.37296, 500=19.82474 (USD); Supplier Part Number 1: 557-MT53E1G32D2FW-046WT:A-ND